# EasyEDA schematic SCH_LaserTag-TTGO_2024-07-18.json
TITLE: Laser Tag Schematic; REV: 2.0; Date: 2024-04-08; Sheet: 1/1; Drawn By: Ed F; Company: Laser Tag
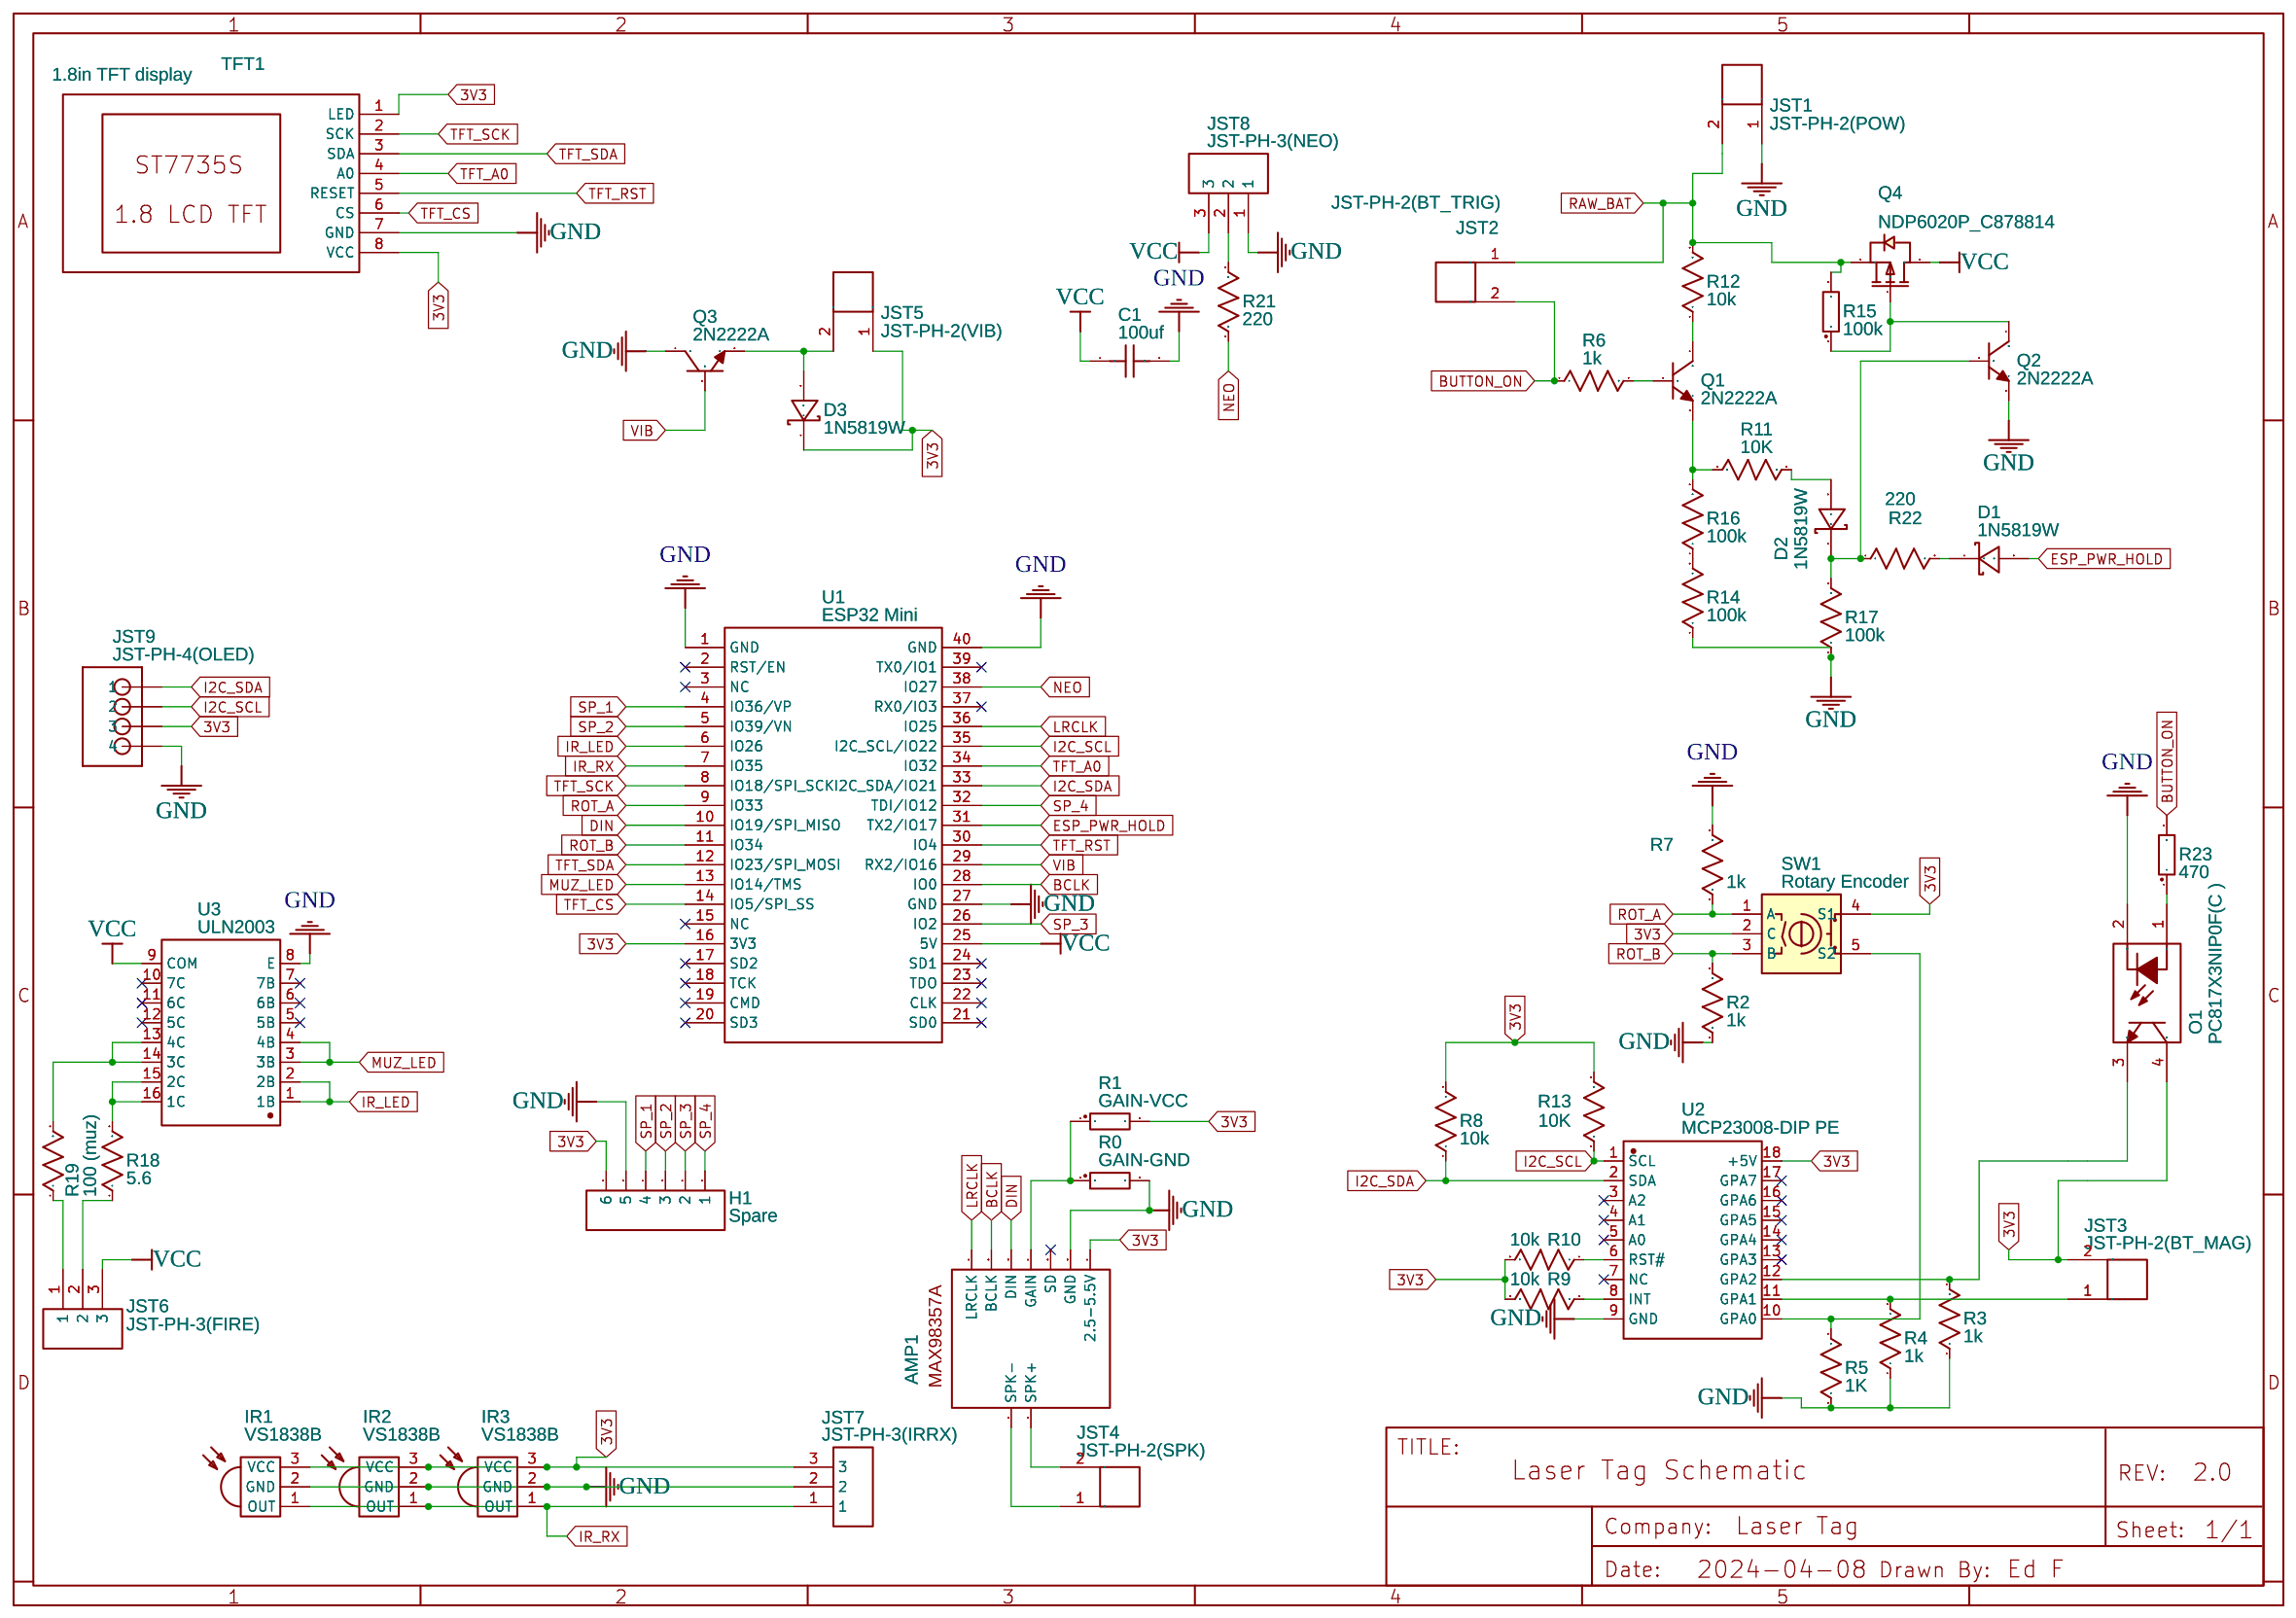
[diagram p0: schematic sheet]

## Parts
AMP1  Amplifier  [MAX98357A]
C1  100uf  [CAPACITOR-TH-CERAMIC-DISK-5MM]
D1  1N5819W  [1N5819W_SS14]
D2  1N5819W  [1N5819W_SS14]
D3  1N5819W  [1N5819W_SS14]
H1  Spare  [POGOPADS6]
IR1  VS1838B  [IR LED VS1838B]
IR2  VS1838B  [IR LED VS1838B]
IR3  VS1838B  [IR LED VS1838B]
JST1  JST-PH-2(POW)  [JST PH 2 PIN]
JST2  JST-PH-2(BT_TRIG)  [JST PH 2 PIN]
JST3  JST-PH-2(BT_MAG)  [JST PH 2 PIN]
JST4  JST-PH-2(SPK)  [JST PH 2 PIN]
JST5  JST-PH-2(VIB)  [JST PH 2 PIN]
JST6  JST-PH-3(FIRE)  [JST PH 3-PIN 2.0MM TOP ENTRY]
JST7  JST-PH-3(IRRX)  [JST PH 3-PIN 2.0MM TOP ENTRY]
JST8  JST-PH-3(NEO)  [JST PH 3-PIN 2.0MM TOP ENTRY]
JST9  JST-PH-4(OLED)  [JST-PH-4-HEADER]
O1  PC817X3NIP0F(C )  [PC817-DIP]
Q1  2N2222A  [TO-92-3_L4.8-W3.7-P2.54-R]
Q2  2N2222A  [TO-92-3_L4.8-W3.7-P2.54-R]
Q3  2N2222A  [TO-92-3_L4.8-W3.7-P2.54-R]
Q4  NDP6020P_C878814  [TO-220AB-3_L10.3-W5.0-P2.54-L]
R0  GAIN-GND  [R0603]
R1  GAIN-VCC  [R0603]
R2  1k  [R0603]
R3  1k  [R0603]
R4  1k  [R0603_NEW]
R5  1K  [R0603]
R6  1k  [R0603_NEW]
R7  1k  [R0603_NEW]
R8  10k  [R0603]
R9  10k  [R0603]
R10  10k  [R0603]
R11  10K  [R0603]
R12  10k  [R0603]
R13  10K  [R0603_NEW]
R14  100k  [R0603]
R15  100k  [R0603]
R16  100k  [R0603]
R17  100k  [R0603]
R18  5.6  [R0603]
R19  100 (muz)  [R0603]
R21  220  [R0603]
R22  220  [R0603]
R23  470  [PTH-RESISTOR-VERTICAL-1W]
SW1  Rotary Encoder  [ROTARYENCODER]
TFT1  1.8in TFT display  [1.8 LCD TFT ST7735S WAVESHARE]
U1  ESP32 Mini  [ESP32 TTGO MINI32]
U2  MCP23008-DIP PE  [MCP23008 SOIC-18_300MIL]
U3  ULN2003  [ULN2003APG-DIP]

## Library data of the parts
AMP1 = I2S MAX98357A MODULE: Manufacturer: Adafruit; Manufacturer Part: 3006; Supplier Part: 3006; link: https://www.adafruit.com/product/3006; Contributor: Andrew Bochkov
C1 = C_0603_US: Contributor: LCEDA_Lib
D1-D3 = 1N5819W: Supplier: LCSC; Supplier Part: C169540; Manufacturer: Shandong Jingdao Microelectronics; Contributor: dwilt; LCSC Assembly: Yes; SMT Type: Extend
H1 = HDR-F-2.54_1x6: Supplier Part: C40877; Supplier: LCSC; Contributor: LCEDA_Lib
IR1-IR3 = VS1838B: Contributor: seregejb
JST1-JST5 = JST PH 2 Pin: Contributor: jessekoska
JST6-JST8 = JST PH 3-PIN 2.0MM TOP ENTRY: Manufacturer Part: JST PH 2-PIN 2.0MM TOP ENTRY; Contributor: liguorigiuseppe780
JST9 = JST-PH-4-HEADER: Contributor: bdmfckr
O1 = PC817X3NIP0F(C ): Supplier: LCSC; Manufacturer: SHARP(夏普); Manufacturer Part: PC817X3NIP0F; Supplier Part: C95782; JLCPCB Part Class: Extended Part
Q1-Q3 = 2N2222A: Contributor: LCSC; Supplier: LCSC; Supplier Part: C358533; Manufacturer: BLUE ROCKET(蓝箭); JLCPCB Part Class: Extended Part
Q4 = NDP6020P_C878814: Contributor: LCSC; Supplier: LCSC; Supplier Part: C878814; Manufacturer: VBsemi(微碧半导体); Manufacturer Part: NDP6020P-VB; JLCPCB Part Class: Extended Part
R0 R1 R15 R23 = PTH-RESISTOR-VERT-1W: Contributor: Ahmad Amarullah
R2-R14 R16-R19 R21 R22 = R_0603_US: Contributor: LCEDA_Lib
SW1 = Rotary Encoder: Contributor: nuttamon.mal
TFT1 = 1.8inch LCD TFT ST7735S Waveshare: Contributor: Рокер
U1 = ESP32 Mini: Contributor: HEOL_Digital_Works
U2 = MCP23008-DIP PE: Supplier: LCSC; Supplier Part: C646745; Manufacturer: MICROCHIP(美国微芯); Manufacturer Part: MCP23008-E/P; Contributor: JohnOniudra; JLCPCB Part Class: Extended Part
U3 = ULN2003APG: Supplier Part: C5251; Supplier: LCSC; Manufacturer: TOSHIBA; Contributor: JAVIERPAREDES; subpart_no: 1

## Nets
3V3: AMP1.H7(2.5-5.5V) D3.1 H1.6 IR1.3(VCC) IR2.3(VCC) IR3.3(VCC) JST3.2 JST5.1 JST7.3 JST9.3 O1.4(COL) R1.2 R8.2 R9.2 R10.2 R13.2 SW1.2(C) SW1.4(S1) TFT1.1(LED) TFT1.8(VCC) U1.16(3V3) U2.18(+5V)
GND: AMP1.H6(GND) C1.2 H1.5 IR1.2(GND) IR2.2(GND) IR3.2(GND) JST1.1 JST7.2 JST8.1 JST9.4 O1.2(CAT) Q2.3(E) Q3.1(C) R0.2 R2.1 R3.1 R4.1 R5.1 R7.2 R14.1 R17.1 TFT1.7(GND) U1.1(GND) U1.27(GND) U1.40(GND) U2.9(GND) U3.8(E)
VCC: C1.1 JST6.3 JST8.3 Q4.2(D) U1.25(5V) U3.9(COM)
BCLK: AMP1.H2(BCLK) U1.28(IO0)
BUTTON_ON: JST2.2 R6.1 R23.2
DIN: AMP1.H3(DIN) U1.10(IO19/SPI MISO)
ESP_PWR_HOLD: D1.2 U1.31(TX2/IO17)
I2C_SCL: JST9.2 R13.1 U1.35(I2C SCL/IO22) U2.1(SCL)
I2C_SDA: JST9.1 R8.1 U1.33(I2C SDA/IO21) U2.2(SDA)
IR_LED: U1.6(IO26) U3.1(1B) U3.2(2B)
IR_RX: IR1.1(OUT) IR2.1(OUT) IR3.1(OUT) JST7.1 U1.7(IO35)
LRCLK: AMP1.H1(LRCLK) U1.36(IO25)
MUZ_LED: U1.13(IO14/TMS) U3.3(3B) U3.4(4B)
NEO: R21.1 U1.38(IO27)
RAW_BAT: JST1.2 JST2.1 Q4.3(S) R12.2 R15.2
ROT_A: R7.1 SW1.1(A) U1.9(IO33)
ROT_B: R2.2 SW1.3(B) U1.11(IO34)
SP_1: H1.4 U1.4(IO36/VP)
SP_2: H1.3 U1.5(IO39/VN)
SP_3: H1.2 U1.26(IO2)
SP_4: H1.1 U1.32(TDI/IO12)
TFT_A0: TFT1.4(A0) U1.34(IO32)
TFT_CS: TFT1.6(CS) U1.14(IO5/SPI SS)
TFT_RST: TFT1.5(RESET) U1.30(IO4)
TFT_SCK: TFT1.2(SCK) U1.8(IO18/SPI SCK)
TFT_SDA: TFT1.3(SDA) U1.12(IO23/SPI MOSI)
VIB: Q3.2(B) U1.29(RX2/IO16)
Net-(AMP1-H4): AMP1.H4(GAIN) R0.1 R1.1
Net-(AMP1-H8): AMP1.H8(SPK-) JST4.1
Net-(AMP1-H9): AMP1.H9(SPK+) JST4.2
Net-(D1-1): D1.1 R22.2
Net-(D2-1): D2.1 Q2.2(B) R17.2 R22.1
Net-(D2-2): D2.2 R11.2
Net-(D3-2): D3.2 JST5.2 Q3.3(E)
Net-(JST3-1): JST3.1 R4.2 U2.11(GPA1)
Net-(JST6-1): JST6.1 R19.1
Net-(JST6-2): JST6.2 R18.1
Net-(JST8-2): JST8.2 R21.2
Net-(O1-1): O1.1(AN) R23.1
Net-(O1-3): O1.3(EM) R3.2 U2.12(GPA2)
Net-(Q1-1): Q1.1(C) R12.1
Net-(Q1-2): Q1.2(B) R6.2
Net-(Q1-3): Q1.3(E) R11.1 R16.2
Net-(Q2-1): Q2.1(C) Q4.1(G) R15.1
Net-(R5-2): R5.2 SW1.5(S2) U2.10(GPA0)
Net-(R9-1): R9.1 U2.8(INT)
Net-(R10-1): R10.1 U2.6(RST#)
Net-(R14-2): R14.2 R16.1
Net-(R18-2): R18.2 U3.15(2C) U3.16(1C)
Net-(R19-2): R19.2 U3.13(4C) U3.14(3C)

Not connected (* = marked no-connect by the designer): AMP1 H5(SD)*; U1 2(RST/EN)* 3(NC)* 15(NC)* 17(SD2)* 18(TCK)* 19(CMD)* 20(SD3)* 21(SD0)* 22(CLK)* 23(TDO)* 24(SD1)* 37(RX0/IO3)* 39(TX0/IO1)*; U2 3(A2)* 4(A1)* 5(A0)* 7(NC)* 13(GPA3)* 14(GPA4)* 15(GPA5)* 16(GPA6)* 17(GPA7)*; U3 5(5B)* 6(6B)* 7(7B)* 10(7C)* 11(6C)* 12(5C)*
